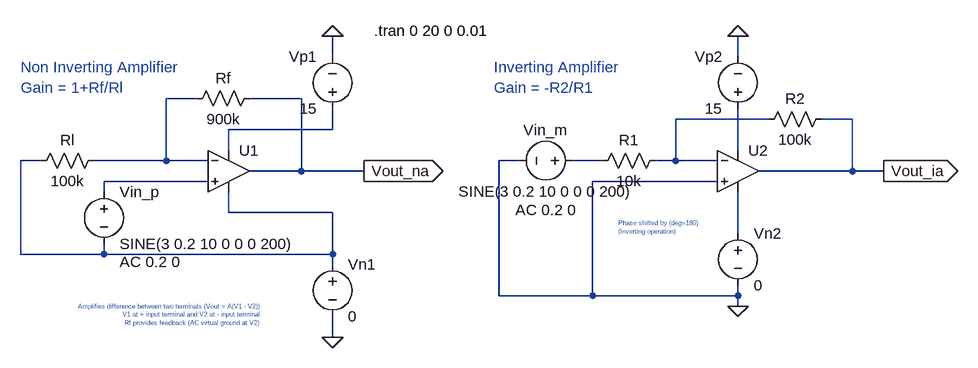
[diagram p0: schematic Universal OpAmp.asc]
Universal OpAmp.asc, the LTspice schematic file:
Version 4.1
SHEET 1 1412 680
WIRE 416 -16 416 -48
WIRE 1040 -16 1040 -48
WIRE 208 48 160 48
WIRE 368 48 288 48
WIRE 1088 80 944 80
WIRE 1216 80 1168 80
WIRE 416 96 416 64
WIRE 416 96 256 96
WIRE 256 128 256 96
WIRE 1040 128 1040 64
WIRE -32 144 -64 144
WIRE 160 144 160 48
WIRE 160 144 48 144
WIRE 224 144 160 144
WIRE 704 144 672 144
WIRE 832 144 784 144
WIRE 944 144 944 80
WIRE 944 144 912 144
WIRE 1008 144 944 144
WIRE 368 160 368 48
WIRE 368 160 288 160
WIRE 464 160 368 160
WIRE 1216 160 1216 80
WIRE 1216 160 1072 160
WIRE 1264 160 1216 160
WIRE 224 176 64 176
WIRE 1008 176 816 176
WIRE 64 192 64 176
WIRE 256 224 256 192
WIRE 416 224 256 224
WIRE 1040 256 1040 192
WIRE -64 288 -64 144
WIRE 64 288 64 272
WIRE 64 288 -64 288
WIRE 416 288 416 224
WIRE 416 288 64 288
WIRE 416 304 416 288
WIRE 672 352 672 144
WIRE 816 352 816 176
WIRE 816 352 672 352
WIRE 1040 352 1040 336
WIRE 1040 352 816 352
WIRE 1040 368 1040 352
WIRE 416 416 416 384
FLAG 464 160 Vout_na
IOPIN 464 160 Out
FLAG 416 416 0
FLAG 416 -48 0
FLAG 1040 368 0
FLAG 1040 -48 0
FLAG 1264 160 Vout_ia
IOPIN 1264 160 Out
SYMBOL voltage 64 176 R0
WINDOW 123 24 124 Left 2
WINDOW 39 0 0 Left 0
SYMATTR Value2 AC 0.2 0
SYMATTR InstName Vin_p
SYMATTR Value SINE(3 0.2 10 0 0 0 200)
SYMBOL res 64 128 R90
WINDOW 0 0 56 VBottom 2
WINDOW 3 32 56 VTop 2
SYMATTR InstName Rl
SYMATTR Value 100k
SYMBOL res 304 32 R90
WINDOW 0 0 56 VBottom 2
WINDOW 3 32 56 VTop 2
SYMATTR InstName Rf
SYMATTR Value 900k
SYMBOL OpAmps\\UniversalOpAmp 256 160 R0
SYMATTR InstName U1
SYMBOL voltage 416 288 R0
WINDOW 123 0 0 Left 0
WINDOW 39 0 0 Left 0
SYMATTR InstName Vn1
SYMATTR Value 0
SYMBOL voltage 416 80 R180
WINDOW 0 24 96 Left 2
WINDOW 3 24 16 Left 2
WINDOW 123 0 0 Left 0
WINDOW 39 0 0 Left 0
SYMATTR InstName Vp1
SYMATTR Value 15
SYMBOL OpAmps\\UniversalOpAmp 1040 160 R0
SYMATTR InstName U2
SYMBOL voltage 1040 80 R180
WINDOW 0 24 96 Left 2
WINDOW 3 24 16 Left 2
WINDOW 123 0 0 Left 0
WINDOW 39 0 0 Left 0
SYMATTR InstName Vp2
SYMATTR Value 15
SYMBOL voltage 1040 240 R0
WINDOW 123 0 0 Left 0
WINDOW 39 0 0 Left 0
SYMATTR InstName Vn2
SYMATTR Value 0
SYMBOL voltage 800 144 R90
WINDOW 0 -32 56 VBottom 2
WINDOW 3 32 56 VTop 2
WINDOW 123 60 56 VTop 2
WINDOW 39 0 0 Left 0
SYMATTR InstName Vin_m
SYMATTR Value SINE(3 0.2 10 0 0 0 200)
SYMATTR Value2 AC 0.2 0
SYMBOL res 928 128 R90
WINDOW 0 0 56 VBottom 2
WINDOW 3 32 56 VTop 2
SYMATTR InstName R1
SYMATTR Value 10k
SYMBOL res 1184 64 R90
WINDOW 0 0 56 VBottom 2
WINDOW 3 32 56 VTop 2
SYMATTR InstName R2
SYMATTR Value 100k
TEXT 480 -56 Left 2 !.tran 0 20 0 0.01
TEXT 304 368 Right 0 ;Amplifies difference between two terminals (Vout = A(V1 - V2))\nV1 at + input terminal and V2 at - input terminal\nRf provides feedback (AC virtual ground at V2)
TEXT -64 0 Left 2 ;Non Inverting Amplifier\nGain = 1+Rf/Rl
TEXT 664 0 Left 2 ;Inverting Amplifier\nGain = -R2/R1
TEXT 856 240 Left 0 ;Phase shifted by (deg=180)\n(Inverting operation)

The netlist it stands for:
* Universal OpAmp.asc
Vin_p N007 N005 SINE(3 0.2 10 0 0 0 200) AC 0.2 0
Rl N001 N005 100k
Rf Vout_na N001 900k
X§U1 N007 N001 N003 N005 Vout_na level1 Avol=1Meg GBW=10Meg Vos=0 En=0 Enk=0 In=0 Ink=0 Rin=500Meg  ; pins In+ In- V+ V- OUT
Vn1 N005 0 0
Vp1 N003 0 15
X§U2 0 N002 N004 N008 Vout_ia level1 Avol=1Meg GBW=10Meg Vos=0 En=0 Enk=0 In=0 Ink=0 Rin=500Meg  ; pins In+ In- V+ V- OUT
Vp2 N004 0 15
Vn2 N008 0 0
Vin_m N006 0 SINE(3 0.2 10 0 0 0 200) AC 0.2 0
R1 N002 N006 10k
R2 Vout_ia N002 100k
.tran 0 20 0 0.01
* Amplifies difference between two terminals (Vout = A(V1 - V2))
* V1 at + input terminal and V2 at - input terminal
* Rf provides feedback (AC virtual ground at V2)
* Non Inverting Amplifier
* Gain = 1+Rf/Rl
* Inverting Amplifier
* Gain = -R2/R1
* Phase shifted by (deg=180)
* (Inverting operation)
.lib UniversalOpAmp1.lib
.backanno
.end